# Altium schematic sheet Integrated_Main_Driver_Board-01-Minimum System Circuit-20230110.SchDoc
size A4
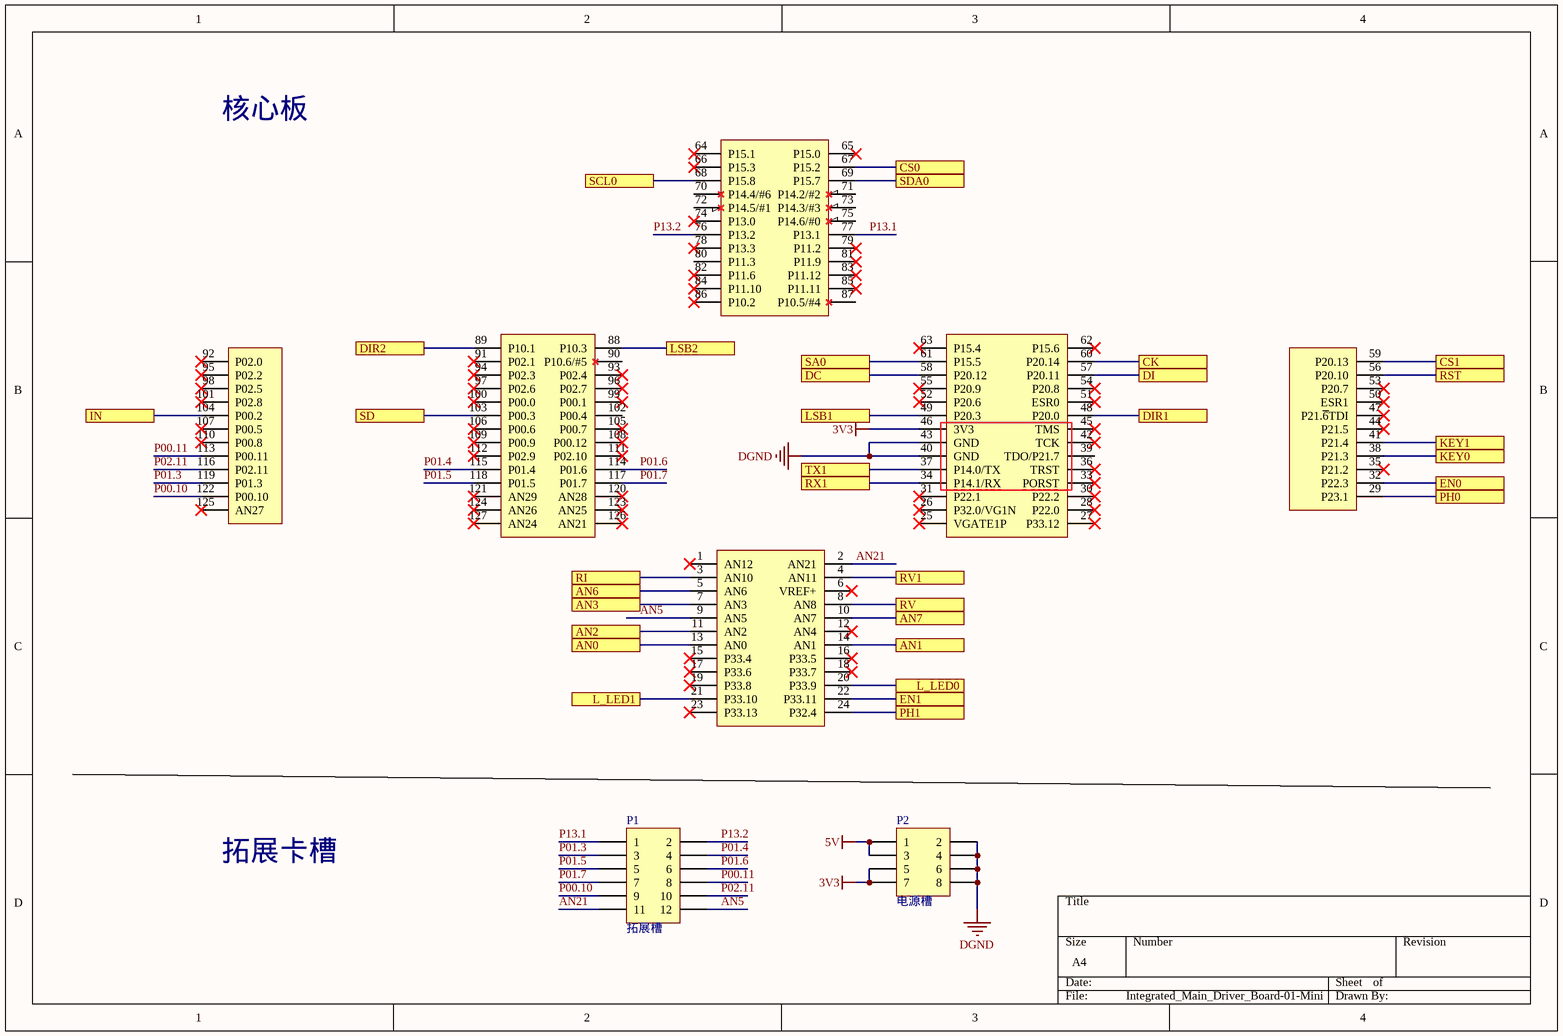
[diagram p0: Integrated_Main_Driver_Board-01-Minimum System Circuit-20230110.SchDoc]

## Parts
LQ-TC1  LQ-TC3X7-SYSVB  [TC377]  (value not drawn)
P1  拓展槽  [HDR2X6]
P2  电源槽  [HDR2X4]

## Ports
AN0, AN1, AN2, AN3, AN6, AN7, CK, CS0, CS1, DC, DI, DIR1, DIR2, EN0, EN1, IN, KEY0, KEY1, L_LED0, L_LED1, LSB1, LSB2, PH0, PH1, RI, RST, RV, RV1, RX1, SA0, SCL0, SD, SDA0, TX1

## Nets
3V3: LQ-TC1.46(3V3) P2.5 P2.7
5V: P2.1 P2.3
DGND: LQ-TC1.40(GND) LQ-TC1.43(GND) P2.2 P2.4 P2.6 P2.8
AN0: LQ-TC1.13(AN0) ; port AN0
AN1: LQ-TC1.14(AN1) ; port AN1
AN2: LQ-TC1.11(AN2) ; port AN2
AN3: LQ-TC1.7(AN3) ; port AN3
AN5: LQ-TC1.9(AN5) P1.12
AN6: LQ-TC1.5(AN6) ; port AN6
AN7: LQ-TC1.10(AN7) ; port AN7
AN21: LQ-TC1.2(AN21) P1.11
CK: LQ-TC1.60(P20.14) ; port CK
CS0: LQ-TC1.67(P15.2) ; port CS0
CS1: LQ-TC1.59(P20.13) ; port CS1
DC: LQ-TC1.58(P20.12) ; port DC
DI: LQ-TC1.57(P20.11) ; port DI
DIR1: LQ-TC1.48(P20.0) ; port DIR1
DIR2: LQ-TC1.89(P10.1) ; port DIR2
EN0: LQ-TC1.32(P22.3) ; port EN0
EN1: LQ-TC1.22(P33.11) ; port EN1
IN: LQ-TC1.104(P00.2) ; port IN
KEY0: LQ-TC1.38(P21.3) ; port KEY0
KEY1: LQ-TC1.41(P21.4) ; port KEY1
L_LED0: LQ-TC1.20(P33.9) ; port L_LED0
L_LED1: LQ-TC1.21(P33.10) ; port L_LED1
LSB1: LQ-TC1.49(P20.3) ; port LSB1
LSB2: LQ-TC1.88(P10.3) ; port LSB2
P00.10: LQ-TC1.122(P00.10) P1.9
P00.11: LQ-TC1.113(P00.11) P1.8
P01.3: LQ-TC1.119(P01.3) P1.3
P01.4: LQ-TC1.115(P01.4) P1.4
P01.5: LQ-TC1.118(P01.5) P1.5
P01.6: LQ-TC1.114(P01.6) P1.6
P01.7: LQ-TC1.117(P01.7) P1.7
P02.11: LQ-TC1.116(P02.11) P1.10
P13.1: LQ-TC1.77(P13.1) P1.1
P13.2: LQ-TC1.76(P13.2) P1.2
PH0: LQ-TC1.29(P23.1) ; port PH0
PH1: LQ-TC1.24(P32.4) ; port PH1
RI: LQ-TC1.3(AN10) ; port RI
RST: LQ-TC1.56(P20.10) ; port RST
RV: LQ-TC1.8(AN8) ; port RV
RV1: LQ-TC1.4(AN11) ; port RV1
RX1: LQ-TC1.34(P14.1/RX) ; port RX1
SA0: LQ-TC1.61(P15.5) ; port SA0
SCL0: LQ-TC1.68(P15.8) ; port SCL0
SD: LQ-TC1.103(P00.3) ; port SD
SDA0: LQ-TC1.69(P15.7) ; port SDA0
TX1: LQ-TC1.37(P14.0/TX) ; port TX1

Not connected (* = marked no-connect by the designer): LQ-TC1 1(AN12)* 6(VREF+)* 12(AN4)* 15(P33.4)* 16(P33.5)* 17(P33.6)* 18(P33.7)* 19(P33.8)* 23(P33.13)* 25(VGATE1P)* 26(P32.0/VG1N)* 27(P33.12)* 28(P22.0)* 30(P22.2)* 31(P22.1)* 33(PORST)* 35(P21.2)* 36(TRST)* 39(TDO/P21.7) 42(TCK)* 44(P21.5)* 45(TMS)* 47(P21.~{6}TDI)* 50(ESR1)* 51(ESR0)* 52(P20.6)* 53(P20.7)* 54(P20.8)* 55(P20.9)* 62(P15.6)* 63(P15.4)* 64(P15.1)* 65(P15.0)* 66(P15.3)* 70(P14.4/#6) 71(P14.2/#2) 72(P14.5/#1) 73(P14.3/#3) 74(P13.0)* 75(P14.6/#0) 78(P13.3)* 79(P11.2)* 80(P11.3) 81(P11.9)* 82(P11.6)* 83(P11.12)* 84(P11.10)* 85(P11.11)* 86(P10.2)* 87(P10.5/#4) 90(P10.6/#5) 91(P02.1)* 92(P02.0)* 93(P02.4)* 94(P02.3)* 95(P02.2)* 96(P02.7)* 97(P02.6)* 98(P02.5)* 99(P00.1)* 100(P00.0)* 101(P02.8)* 102(P00.4) 105(P00.7)* 106(P00.6)* 107(P00.5)* 108(P00.12)* 109(P00.9)* 110(P00.8)* 111(P02.10)* 112(P02.9)* 120(AN28)* 121(AN29)* 123(AN25)* 124(AN26)* 125(AN27)* 126(AN21)* 127(AN24)*

## Notes on the sheet
- (near LQ-TC1) 核心板
- 拓展卡槽

## Library data of the parts
P1 = Header 6X2: Header, 6-Pin, Dual row; LatestRevisionDate: 17-Jul-2002; LatestRevisionNote: Re-released for DXP Platform.; Publisher: Altium Limited
P2 = Header 4X2: Header, 4-Pin, Dual row; LatestRevisionDate: 17-Jul-2002; LatestRevisionNote: Re-released for DXP Platform.; Publisher: Altium Limited